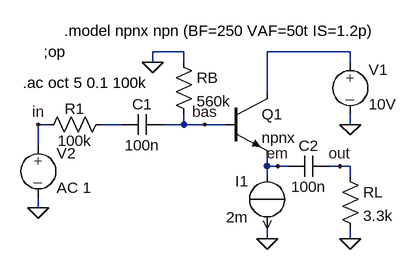
[diagram p0: schematic e-folger-1.asc]
e-folger-1.asc, the LTspice schematic file:
Version 4
SHEET 1 880 680
WIRE 96 48 48 48
WIRE 352 48 224 48
WIRE 48 64 48 48
WIRE 96 64 96 48
WIRE 352 64 352 48
WIRE 224 112 224 48
WIRE -112 160 -128 160
WIRE 0 160 -32 160
WIRE 96 160 96 144
WIRE 96 160 64 160
WIRE 128 160 96 160
WIRE 160 160 128 160
WIRE 352 160 352 144
WIRE -128 192 -128 160
WIRE 224 224 224 208
WIRE 240 224 224 224
WIRE 256 224 240 224
WIRE 336 224 320 224
WIRE 352 224 336 224
WIRE 224 240 224 224
WIRE 352 240 352 224
WIRE -128 288 -128 272
WIRE 224 336 224 320
WIRE 352 336 352 320
FLAG 352 160 0
FLAG 224 336 0
FLAG 352 336 0
FLAG -128 288 0
FLAG 336 224 out
FLAG 240 224 em
FLAG 128 160 bas
FLAG -128 160 in
FLAG 48 64 0
SYMBOL EIT_Semiconductors\\npn 160 112 R0
SYMATTR InstName Q1
SYMATTR Value npnx
SYMBOL source-V 352 48 R0
SYMATTR InstName V1
SYMATTR Value 10V
SYMBOL res 80 48 R0
SYMATTR InstName RB
SYMATTR Value 560k
SYMBOL source-I 224 320 R180
WINDOW 0 29 73 Left 2
WINDOW 3 29 17 Left 2
SYMATTR InstName I1
SYMATTR Value 2m
SYMBOL res 336 224 R0
SYMATTR InstName RL
SYMATTR Value 3.3k
SYMBOL cap 256 240 R270
WINDOW 0 32 32 VTop 2
WINDOW 3 0 32 VBottom 2
SYMATTR InstName C2
SYMATTR Value 100n
SYMBOL cap 0 176 R270
WINDOW 0 32 32 VTop 2
WINDOW 3 0 32 VBottom 2
SYMATTR InstName C1
SYMATTR Value 100n
SYMBOL res -128 176 R270
WINDOW 0 25 56 VTop 2
WINDOW 3 7 56 VBottom 2
SYMATTR InstName R1
SYMATTR Value 100k
SYMBOL source-V -128 176 R0
SYMATTR InstName V2
SYMATTR Value AC 1
TEXT -88 16 Left 2 !.model npnx npn (BF=250 VAF=50t IS=1.2p)
TEXT -120 48 Left 2 !;op
TEXT -152 96 Left 2 !.ac oct 5 0.1 100k

The netlist it stands for:
* e-folger-1.asc
Q1 N001 bas em 0 npnx
V1 N001 0 10V
RB 0 bas 560k
I1 em 0 2m
RL out 0 3.3k
C2 em out 100n
C1 N002 bas 100n
R1 in N002 100k
V2 in 0 AC 1
.model NPN NPN
.model PNP PNP
.lib standard.bjt
.model npnx npn (BF=250 VAF=50t IS=1.2p)
;op
.ac oct 5 0.1 100k
.backanno
.end